# EAGLE design lm3410-sepic-led-driver-16mm-mk-2 (EAGLE 6.5.0)
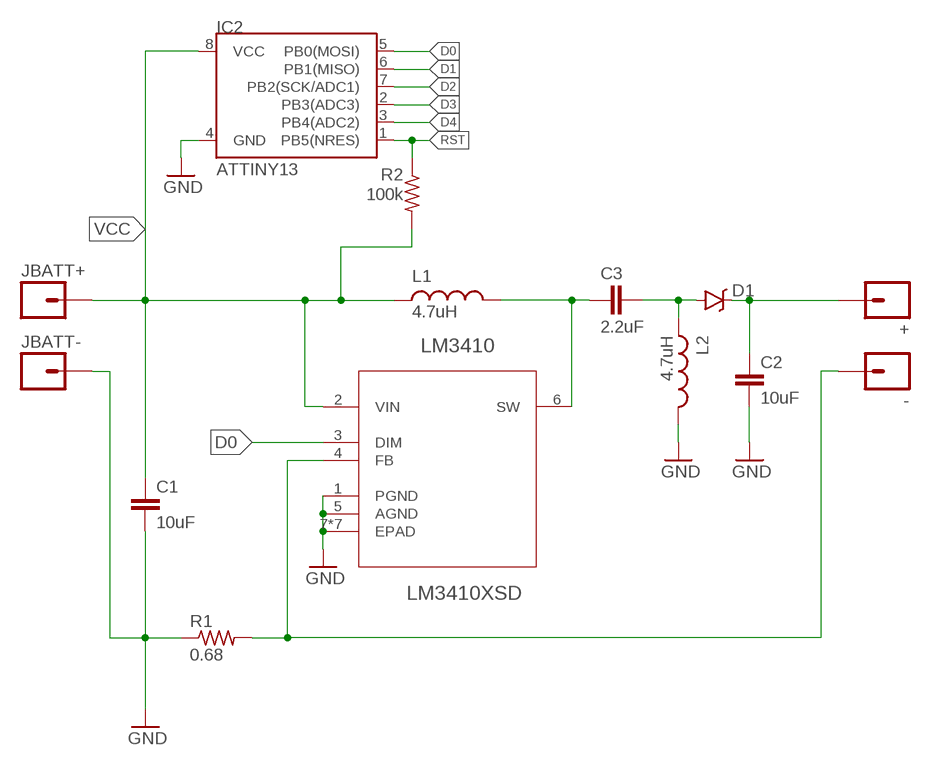
[diagram p0: schematic, sheet 1]

## Parts
+  M01PTH-KIT  [1X01-KIT]
-  M01NOSILK-KIT  [1X01NS-KIT]
C1  10uF  CAPACITOR-CERAMICC0603  [C0603]
C2  10uF  CAPACITOR-CERAMICC0603  [C0603]
C3  2.2uF  CAPACITOR-CERAMICC0805  [C0805]
D1  BAT20J  DIODE-SCHOTTKYBAT20J  [SOD-323]
IC2  ATTINY13  ATTINY13SOIC  [SO08]
JBATT+  M01NOT-A-VIA-NOPE  [1X01_NOSILK_NOSTOP]
JBATT-  M01NOT-A-VIA-NOPE  [1X01_NOSILK_NOSTOP]
L1  4.7uH  INDUCTORIFSC-0806  [INDUCTOR_2X1.6MM]
L2  4.7uH  INDUCTORIFSC-0806  [INDUCTOR_2X1.6MM]
LM3410  LM3410XSD  [DFN300X300X80-7N]
R1  0.68  RESISTORR1206  [R1206]
R2  100k  RESISTORR0402  [R0402]

## Nets
D0: IC2.5(PB0(MOSI)) LM3410.3(DIM)
D1: IC2.6(PB1(MISO))
D2: IC2.7(PB2(SCK/ADC1))
D3: IC2.2(PB3(ADC3))
D4: IC2.3(PB4(ADC2))
GND: C1.2 C2.2 IC2.4(GND) JBATT-.P$1 L2.P$2 LM3410.1(PGND) LM3410.5(AGND) LM3410.7(EPAD) LM3410.7@1(EPAD) LM3410.7@2(EPAD) LM3410.7@3(EPAD) LM3410.7@4(EPAD) LM3410.7@5(EPAD) LM3410.7@6(EPAD) R1.1
LED_ANODE: +.1 C2.1 D1.C
N$1: C3.2 D1.A L2.P$1
N$6: -.1 LM3410.4(FB) R1.2
RST: IC2.1(PB5(NRES)) R2.1
SW: C3.1 L1.P$2 LM3410.6(SW)
VCC: C1.1 IC2.8(VCC) JBATT+.P$1 L1.P$1 LM3410.2(VIN) R2.2

## Library data of the parts
+ - JBATT+ JBATT- = A_butts:M01: Header 1 Standard 1-pin 0.1" header. Use with straight break away headers (SKU : PRT-00116), right angle break away headers (PRT-00553), swiss pins (PRT-00743), machine pins (PRT-00117), and female headers (PRT-00115).
C1-C3 = A_butts:CAPACITOR-CERAMIC: CAPACITOR, European symbol
D1 = A_butts:DIODE-SCHOTTKY: Schottky diodes in SFE's production catalog BAT20J 1A 23V 0.62Vf RB751 120mA 40V 0.37Vf PMEG4005EJ 0.5A 40V 0.42Vf MBRA140 1A 40V 0.5Vf B340A 3A 40V SMA; PROD_ID: DIO-11623
IC2 = A_butts:ATTINY13: Atmel 8-pin 1kB flash uC
L1 L2 = A_butts:INDUCTOR: Inductors Basic Inductor/Choke - 0603 and 1206. Footprints are not proven and vary greatly between part numbers. SRN6045- 33uH, 20% 1.4A SDR0403-560KL - 56uH, 10%, 500mA RMS/740mA peak
LM3410 = A_butts:LM3410XSD: Constant Current Boost and SEPIC LED Driver; MPN: LM3410XSD; OC_FARNELL: -; OC_NEWARK: 11N9218; PACKAGE: DFN-6; SUPPLIER: National Semiconductor
R1 R2 = A_butts:RESISTOR: RESISTOR, American symbol

## Board
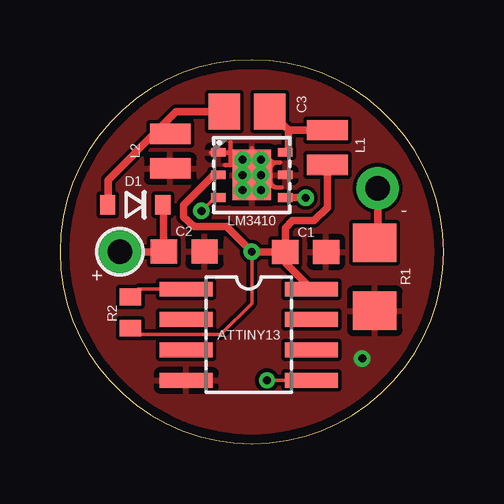
[diagram p1: board, top side]
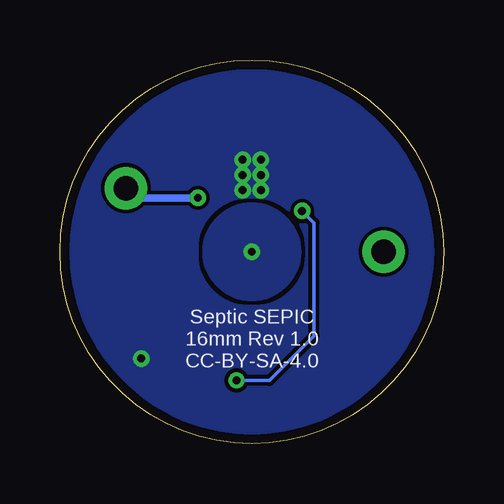
[diagram p2: board, bottom side, seen from below]

Size 16 x 16 mm. Coordinates in mm from the lower left corner, seen from the top.
Outline: 0,8 arc90 8,0 arc90 16,8 arc90 8,16 arc90 0,8
Copper layers (1*16): Top 0.0356mm / dielectric 1.5011mm / Bottom 0.0356mm
Design rules "LaenPCBOrder2": minimum track width 6mil, minimum drill 13mil, track to track 6mil, track to pad 6mil, pad to pad 6mil, via to via 6mil, smd to smd 6mil, copper to edge 15mil, drill to drill 6mil, minimum pad ring 7mil, minimum via ring 7mil, stop-mask expansion 3mil, vias tented up to drill 20mil, thermal gap 10mil

### Footprints (pad centres in the part's own frame; a part is rotated, then mirrored left to right if it is on the bottom)
1X01-KIT = drill 1.016 pad 1.778: 1 0,0
1X01NS-KIT = drill 1.016 pad 1.778: 1 0,0
C0603 = smd 1.1 x 1: 1 -0.85,0; 2 0.85,0
C0805 = smd 1.3 x 1.5: 1 -0.95,0; 2 0.95,0
SOD-323 = smd 0.63 x 0.83: A 1.15,0; C -1.15,0
SO08 = smd 0.61 x 2.21: 1 -1.905,-2.616; 2 -0.635,-2.616; 3 0.635,-2.616; 4 1.905,-2.616; 5 1.905,2.616; 6 0.635,2.616; 7 -0.635,2.616; 8 -1.905,2.616
1X01_NOSILK_NOSTOP = drill 0.33: P$1 0,0
INDUCTOR_2X1.6MM = smd 0.85 x 1.7: P$1 -0.725,0; P$2 0.725,0
DFN300X300X80-7N = smd 0.61 x 0.356: 1 -1.397,0.94; 2 -1.397,0; 3 -1.397,-0.94; 4 1.397,-0.94; 5 1.397,0; 6 1.397,0.94 | smd 1.6 x 2.108: 7 0,0 | drill 0.33: 7@1 -0.381,0.635; 7@2 0.381,0.635; 7@3 0.381,-0.635; 7@4 -0.381,-0.635; 7@5 -0.381,0; 7@6 0.381,0
R1206 = smd 1.6 x 1.803: 1 -1.422,0; 2 1.422,0
R0402 = smd 0.7 x 0.9: 1 -0.65,0; 2 0.65,0

### Placement (x,y rotation side)
+  2.5,8 0 top
-  13.25,10.65 0 top
C1  10.25,8 0 top
C2  5.18,8.02 0 top
C3  7.8,13.85 180 top
D1  3.14,9.96 180 top
IC2  7.88,4.54 270 top
JBATT+  8,8 0 top
JBATT-  12.61,3.55 0 top
L1  11.15,12.35 90 top
L2  4.6,12.2 270 top
LM3410  8,11.2 0 top
R1  13.13,6.96 90 top
R2  2.93,5.46 270 top

### Tracks (layer width: path | path; a pad name or v marks a point on that pad's centre or on a via)
D0  (via drill 0.33)
  Top 0.152: LM3410.3 6.46,10.26 v5.9,9.7 | IC2.5 v8.63,2.63
  Bottom 0.152: v5.9,9.7 5.4,9.2 5.4,4.5 7.26,2.63 v8.63,2.63
GND
  Top 0.18: 6.88,11.62 7.12,11.62 7.12,12.14 | 7.12,12.14 7.12,12.57 | 6.31,12.14 7.12,12.14 | 9.23,10.68 9.04,10.68 arc-90 8.79,10.93 8.79,11.47 arc-90 9.04,11.72 | 9.04,11.72 9.17,11.72 | 9.04,11.72 8.96,11.72 arc-90 8.71,11.97 8.71,12.14 8.18,12.14 arc-90 8,12.32
  pour Bottom (rank 6): 8,0 arc-90 0,8 arc-90 8,16 arc-90 16,8 arc-90
  pour Top (rank 6): 8,0 arc-90 0,8 arc-90 8,16 arc-90 16,8 arc-90
LED_ANODE
  Top 0.305: D1.C 4.33,9.92 C2.1 4.31,8 +.1
N$1
  Top 0.305: C3.2 4.85,13.85 4.2,13.2 | 4.2,13.2 2,11 D1.A | L2.P$1 4.47,12.93 4.2,13.2
N$6  (via drill 0.33)
  Top 0.305: LM3410.4 v10.24,10.26 v10.25,10.25 | -.1 13.25,8.5 R1.2
  Bottom 0.305: v10.25,10.25 12.85,10.25 -.1
RST
  Top 0.152: IC2.1 3.27,6.45 R2.1
SW
  Top 0.305: C3.1 9.53,13.07 | 9.53,13.07 L1.P$2 | LM3410.6 9.53,12.27 9.53,13.07
VCC
  Top 0.152: 3.3,4.78 R2.2 3.19,4.55 6.7,4.55 8,5.85 JBATT+.P$1
  Top 0.305: LM3410.2 6.4,11.2 5.15,9.95 5.15,9.45 5.6,9.05 6.95,9.05 JBATT+.P$1 C1.1 | L1.P$1 11.15,9.85 10.6,9.3 9.7,9.3 9.4,9 C1.1 | IC2.8 9.47,7.47 arc-45 9.4,7.65 C1.1
  pour Bottom: 6,8 arc90 8,6 arc90 10,8 arc90 8,10 arc90

### Text on the board
bPlace: Septic SEPIC / 16mm Rev 1.0 / CC-BY-SA-4.0